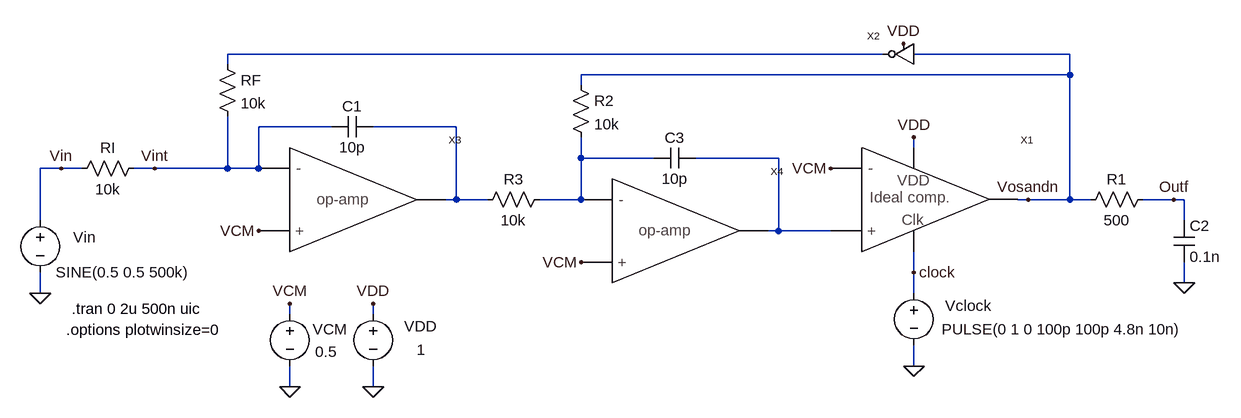
[diagram p0: schematic _Fig6_32_MSD.asc]
_Fig6_32_MSD.asc, the LTspice schematic file:
Version 4
SHEET 1 1456 680
WIRE 880 -160 -128 -160
WIRE 1168 -160 928 -160
WIRE -128 -144 -128 -160
WIRE 1168 -128 1168 -160
WIRE 1168 -128 416 -128
WIRE 416 -112 416 -128
WIRE 32 -48 -80 -48
WIRE 224 -48 96 -48
WIRE 928 -16 928 -32
WIRE 416 0 416 -32
WIRE 528 0 416 0
WIRE 720 0 592 0
WIRE -384 16 -416 16
WIRE -352 16 -384 16
WIRE -240 16 -272 16
WIRE -128 16 -128 -64
WIRE -128 16 -240 16
WIRE -80 16 -80 -48
WIRE -80 16 -128 16
WIRE 224 64 224 -48
WIRE 224 64 208 64
WIRE 272 64 224 64
WIRE 416 64 416 0
WIRE 416 64 352 64
WIRE 1104 64 1088 64
WIRE 1168 64 1168 -128
WIRE 1168 64 1104 64
WIRE 1200 64 1168 64
WIRE 1328 64 1280 64
WIRE 1344 64 1328 64
WIRE -416 96 -416 16
WIRE 1344 96 1344 64
WIRE 720 112 720 0
WIRE 720 112 704 112
WIRE 800 112 720 112
WIRE 928 176 928 144
WIRE 1344 192 1344 160
WIRE -416 208 -416 176
WIRE 928 208 928 176
WIRE -32 240 -32 224
WIRE 96 240 96 224
WIRE 928 320 928 288
WIRE -32 352 -32 320
WIRE 96 352 96 320
FLAG 96 352 0
FLAG 928 -32 VDD
FLAG 96 224 VDD
FLAG 928 320 0
FLAG 928 176 clock
FLAG -32 352 0
FLAG -32 224 VCM
FLAG 1104 64 Vosandn
FLAG -416 208 0
FLAG -384 16 Vin
FLAG -240 16 Vint
FLAG 800 16 VCM
FLAG 912 -176 VDD
FLAG -80 112 VCM
FLAG 1344 192 0
FLAG 1328 64 Outf
FLAG 416 160 VCM
SYMBOL Ideal_clocked_comparator 848 64 R0
SYMATTR InstName X1
SYMBOL voltage 96 224 R0
WINDOW 0 48 35 Left 0
WINDOW 3 67 71 Left 0
SYMATTR InstName VDD
SYMATTR Value 1
SYMBOL voltage 928 192 R0
WINDOW 0 48 35 Left 0
WINDOW 3 43 71 Left 0
WINDOW 123 0 0 Left 0
WINDOW 39 0 0 Left 0
SYMATTR InstName Vclock
SYMATTR Value PULSE(0 1 0 100p 100p 4.8n 10n)
SYMBOL voltage -32 224 R0
WINDOW 0 35 39 Left 0
WINDOW 3 39 74 Left 0
SYMATTR InstName VCM
SYMATTR Value 0.5
SYMBOL cap 32 -32 R270
WINDOW 0 32 32 VTop 0
WINDOW 3 0 32 VBottom 0
SYMATTR InstName C1
SYMATTR Value 10p
SYMBOL res -256 0 R90
WINDOW 0 0 56 VBottom 0
WINDOW 3 32 56 VTop 0
SYMATTR InstName RI
SYMATTR Value 10k
SYMBOL res -144 -160 R0
SYMATTR InstName RF
SYMATTR Value 10k
SYMBOL voltage -416 80 R0
WINDOW 0 51 42 Left 0
WINDOW 123 0 0 Left 0
WINDOW 39 0 0 Left 0
SYMATTR InstName Vin
SYMATTR Value SINE(0.5 0.5 500k)
SYMBOL inverter 928 -160 M0
SYMATTR InstName X2
SYMBOL op_amp -32 64 R0
SYMATTR InstName X3
SYMBOL res 1296 48 R90
WINDOW 0 0 56 VBottom 0
WINDOW 3 32 56 VTop 0
SYMATTR InstName R1
SYMATTR Value 500
SYMBOL cap 1328 96 R0
SYMATTR InstName C2
SYMATTR Value 0.1n
SYMBOL cap 528 16 R270
WINDOW 0 32 32 VTop 0
WINDOW 3 0 32 VBottom 0
SYMATTR InstName C3
SYMATTR Value 10p
SYMBOL op_amp 464 112 R0
SYMATTR InstName X4
SYMBOL res 400 -128 R0
SYMATTR InstName R2
SYMATTR Value 10k
SYMBOL res 256 80 R270
WINDOW 0 32 56 VTop 0
WINDOW 3 0 56 VBottom 0
SYMATTR InstName R3
SYMATTR Value 10k
TEXT -368 232 Left 0 !.tran 0 2u 500n uic
TEXT -376 264 Left 0 !.options plotwinsize=0

The netlist it stands for:
* _Fig6_32_MSD.asc
XX1 VCM N004 Vosandn VDD clock Ideal_clocked_comparator  ; pins Vinm Vinp Vout VDD Clock
VDD VDD 0 1
Vclock clock 0 PULSE(0 1 0 100p 100p 4.8n 10n)
VCM VCM 0 0.5
C1 Vint N002 10p
RI Vint Vin 10k
RF N001 Vint 10k
Vin Vin 0 SINE(0.5 0.5 500k)
XX2 Vosandn N001 VDD inverter  ; pins In Out VDD
XX3 Vint VCM N002 op_amp  ; pins Vinm Vinp Out
R1 Outf Vosandn 500
C2 Outf 0 0.1n
C3 N003 N004 10p
XX4 N003 VCM N004 op_amp  ; pins Vinm Vinp Out
R2 Vosandn N003 10k
R3 N002 N003 10k
.tran 0 2u 500n uic
.options plotwinsize=0
.backanno
.end